# Altium schematic sheet Schemat.SchDoc
size A4
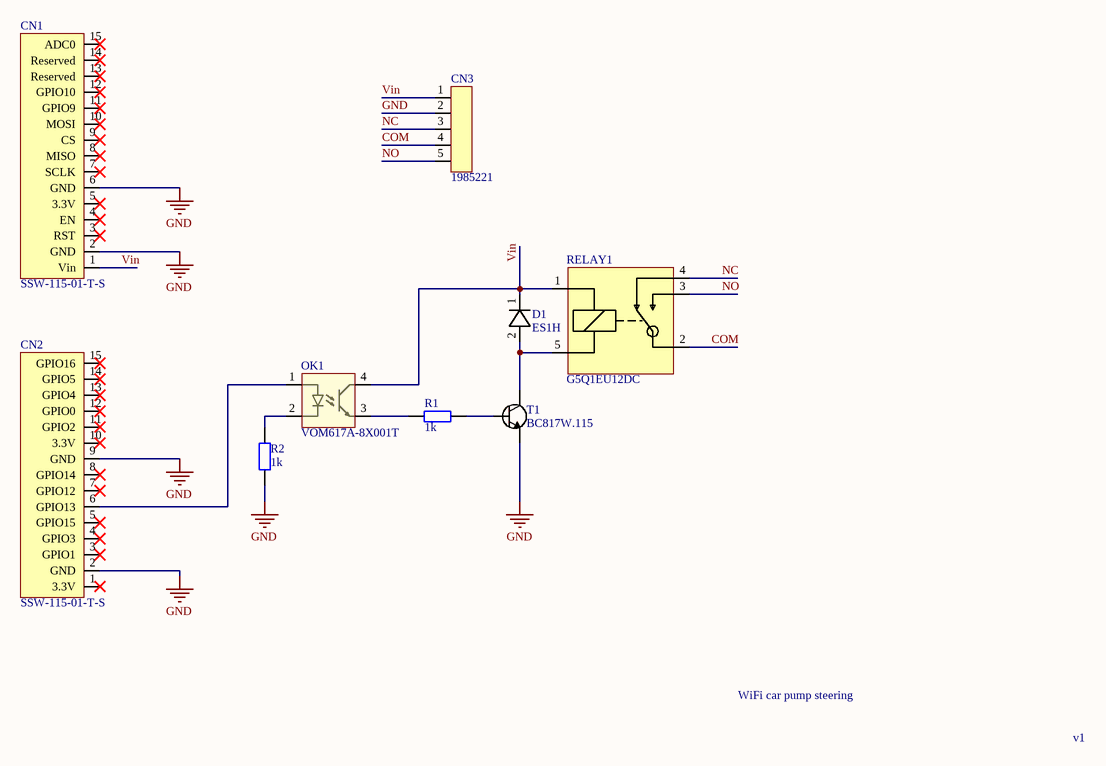
[diagram p0: Schemat.SchDoc]

## Parts
CN1  SSW-115-01-T-S  [SSW-115-01-T-S]
CN2  SSW-115-01-T-S  [SSW-115-01-T-S]
CN3  1985221  [PTSA 1.5/5-3,5-Z]
D1  ES1H  [DIOM4326X25N]
OK1  VOM617A-8X001T  [SOP254P700X200-4M]
R1  Resistance: 1k  [Resistor 1206]  (hidden comment: 1206 resistor)
R2  Resistance: 1k  [Resistor 1206]  (hidden comment: 1206 resistor)
RELAY1  G5Q1EU12DC  [G5Q-1EU 12DC]
T1  BC817W.115  [BC817W.115]

## Nets
GND: CN1.2(GND) CN1.6(GND) CN2.2(GND) CN2.9(GND) CN3.2 R2.2 T1.2(E)
COM: CN3.4 RELAY1.2(COM)
NC: CN3.3 RELAY1.4(NC)
NO: CN3.5 RELAY1.3(NO)
Vin: CN1.1(Vin) CN3.1 D1.1(C) OK1.4(C) RELAY1.1(A1)
NetCN2_6: CN2.6(GPIO13) OK1.1(A)
NetD1_2: D1.2(A) RELAY1.5(A2) T1.3(C)
NetOK1_2: OK1.2(C) R2.1
NetOK1_3: OK1.3(E) R1.1
NetR1_2: R1.2 T1.1(B)

Not connected (* = marked no-connect by the designer): CN1 3(RST)* 4(EN)* 5(3.3V)* 7(SCLK)* 8(MISO)* 9(CS)* 10(MOSI)* 11(GPIO9)* 12(GPIO10)* 13(Reserved)* 14(Reserved)* 15(ADC0)*; CN2 1(3.3V)* 3(GPIO1)* 4(GPIO3)* 5(GPIO15)* 7(GPIO12)* 8(GPIO14)* 10(3.3V)* 11(GPIO2)* 12(GPIO0)* 13(GPIO4)* 14(GPIO5)* 15(GPIO16)*

## Notes on the sheet
- WiFi car pump steering
- v1

## Library data of the parts
CN1 CN2 = SSW-115-01-T-S: SAMTEC         SSW-115-01-T-S             Board-To-Board Connector, SSW Series, 15 Contacts, Receptacle, 2.54 mm, Through Hole, 1 Rows; Number of Positions: 15; Max Current Rating: 6.9A; Contact Resistance: 10mR; Connector Type: Receptacle,Socket; Max Voltage Rating (AC): 550V; Mating Cycles: 100; Pitch: 2.54mm; Supplier 1: Farnell; Manufacturer: Samtec; Manufacturer Part Number: SSW-115-01-T-S; Stock 1: 0; Mount: Through Hole; Color: Black; Contact Plating: Tin,Matte; Contact Material: Bronze; Housing Color: Black; Housing Material: Polymer; Min Operating Temperature: -55°C; Max Operating Temperature: 105°C; Packaging: Bulk; Termination: Solder; Number of Rows: 1; Gender: Receptacle; Number of Contacts: 15; Orientation: Straight; Length: 38.61mm; Width: 2.41mm; Depth: 2.41mm; Radiation Hardening: No; REACH SVHC: No SVHC; Lead Free: Lead Free; ComponentLink1URL: http://suddendocs.samtec.com/prints/ssw-1xx-xx-xxx-x-xx-xxx-xx-mkt.pdf?src-supplier=Digi-Key; ComponentLink1Description: http://suddendocs.samtec.com/prints/ssw-1xx-xx-xxx-x-xx-xxx-xx-mkt.pdf?src-supplier=Digi-Key; Supplier Part Number 1: 1804177
CN3 = 1985221: TERM BLOCK 5POS 45DEG 3.5MM PCB; Manufacturer: Phoenix Contact; Number of Positions: 5; Voltage Rating: 250V; Max Current Rating: 2A; Number of Levels: 1; Voltage: 300V; Wire Gauge (Max): 24AWG; Wire Gauge (Min): 16AWG; Stripping Length: 8mm; Approvals: UL,VDE; Supplier 1: Farnell; Manufacturer Part Number: 1985221; Stock 1: 178; Mount: Through Hole; Number of Pins: 5; Weight: 0.087479oz; Color: Green; Housing Color: Green; Housing Material: Polyamide; Contact Material: Tin; Material: Nylon; Insulation Material: Nylon; Package Quantity: 100; Packaging: Bulk; Termination: Solder; Number of Rows: 1; Number of Contacts: 5; Number of Poles: 5; Max Supply Voltage: 250V; Current Rating: 2A; Number of Positions Per Level: 5; Current: 2A; Number of Circuits: 5; Length: 12mm; Height: 13.1mm; Width: 19mm; Pitch: 3.5mm; Depth: 12mm; Wire/Cable Gauge: 16AWG; Flammability Rating: UL94 V-2; Lead Free: Lead Free; REACH SVHC: Unknown; ComponentLink1URL: http://components.arrow.com/part/dataview/43946157S8410404N1555?src-supplier=Arrow; ComponentLink1Description: http://components.arrow.com/part/dataview/43946157S8410404N1555?src-supplier=Arrow; ComponentLink2URL: https://media.digikey.com/pdf/Data%20Sheets/Phoenix%20Contact%20PDFs/COMBICON%20Spring-Cage%20PCB%20Term.%20Blocks.pdf?src-supplier=Digi-Key; ComponentLink2Description: https://media.digikey.com/pdf/Data%20Sheets/Phoenix%20Contact%20PDFs/COMBICON%20Spring-Cage%20PCB%20Term.%20Blocks.pdf?src-supplier=Digi-Key; Supplier Part Number 1: 1792772
D1 = ES1H: Rectifiers 1A,500V,SUPER FAST Surf Mt Rect; Manufacturer: Taiwan Semiconductor; Reverse Recovery Time: 35ns; Peak Reverse Current: 100uA; Element Configuration: Single; Forward Voltage: 1.7V; Supplier 1: Farnell; Manufacturer Part Number: ES1H; Stock 1: 0; Mount: Surface Mount; Number of Pins: 2; Min Operating Temperature: -55°C; Max Operating Temperature: 150°C; Packaging: Tape and Reel; Package Quantity: 7500; Forward Current: 1A; Max Repetitive Reverse Voltage (Vrrm): 500V; Length: 4.6mm; Height: 2.5mm; Width: 2.83mm; REACH SVHC: No SVHC; Lead Free: Lead Free; ComponentLink1URL: http://uk.rs-online.com/webdocs/1298/0900766b81298786.pdf?src-supplier=RSComponents; ComponentLink1Description: http://uk.rs-online.com/webdocs/1298/0900766b81298786.pdf?src-supplier=RSComponents; ComponentLink2URL: http://www.taiwansemi.com/DSfile/ES1A%20SERIES_H13.pdf?src-supplier=Mouser; ComponentLink2Description: http://www.taiwansemi.com/DSfile/ES1A%20SERIES_H13.pdf?src-supplier=Mouser; Supplier Part Number 1: 2677280
OK1 = VOM617A-8X001T: VISHAY         VOM617A-8X001T             Transistor Output Optocoupler, Low Input Current, 1 Channel, SOP, 4 Pins, 60 mA, 3.75 kV, 130 %; Reverse Breakdown Voltage: 6V; Forward Voltage: 1.6V; Forward Current: 60mA; Max Power Dissipation: 170mW; Number of Channels: 1; Output Voltage: 80V; Collector Emitter Saturation Voltage: 400mV; Max Collector Current: 100mA; Rise Time: 7us; Fall Time: 12us; Isolation Voltage: 3.75kV; Current Transfer Ratio: 260%; Supplier 1: Farnell; Manufacturer: Vishay; Manufacturer Part Number: VOM617A-8X001T; Stock 1: 859; Mount: Surface Mount; Case/Package: SOP; Number of Pins: 4; Min Operating Temperature: -55°C; Max Operating Temperature: 110°C; Packaging: Tape and Reel; Package Quantity: 3000; Collector Emitter Voltage (VCEO): 80V; Output Current per Channel: 100mA; Number of Elements: 1; Power Dissipation: 170mW; Max Input Current: 60mA; Input Current: 60mA; Radiation Hardening: No; REACH SVHC: Unknown; ComponentLink1URL: http://www.farnell.com/datasheets/2050092.pdf?src-supplier=Element14; ComponentLink1Description: http://www.farnell.com/datasheets/2050092.pdf?src-supplier=Element14; ComponentLink2URL: http://www.vishay.com/docs/83446/vom617a.pdf?src-supplier=Avnet+Europe; ComponentLink2Description: http://www.vishay.com/docs/83446/vom617a.pdf?src-supplier=Avnet+Europe; ComponentLink3URL: http://www.vishay.com/docs/83446/vom617a.pdf?src-supplier=Digi-Key; ComponentLink3Description: http://www.vishay.com/docs/83446/vom617a.pdf?src-supplier=Digi-Key; ComponentLink4URL: http://www.vishay.com/docs/83446/vom617a.pdf?src-supplier=Avnet; ComponentLink4Description: http://www.vishay.com/docs/83446/vom617a.pdf?src-supplier=Avnet; Supplier Part Number 1: 2251591
R1 R2 = CRCW1206220RJNTABC: Resistor: thick film; SMD; 1206; 220O; 0.25W; ±5%; -55÷125°C; Manufacturer: Vishay; Power Rating: 250mW; Supplier 1: TME; Manufacturer Part Number: CRCW1206220RJNTABC; Stock 1: 277400; Pricing 1: 100=0.0314, 500=0.01833, 1000=0.01178, 5000=0.005, 15000=0.00487 (USD); Case/Package: 1206; Tolerance: 5%; Lead Free: Contains Lead; Supplier Part Number 1: CRCW1206220RJNTABC
RELAY1 = G5Q1EU12DC: PCB power relay 12 VDC 400 mW, G5Q1EU12DC, Omron Electronic Components; Contact Current Rating: 10A; Coil Resistance: 360R; Coil Current: 33.3mA; Voltage Rating (DC): 30V; Coil Voltage (DC): 12V; Coil Type: Non-Latching; Insulation Resistance: 100MR; Coil Power: 400mW; Throw Configuration: SPDT; Operate Time: 10ms; Voltage Rating (AC): 277V; Switching Capacity: 1.25kW; Ratings: IP67; Supplier 1: Farnell; Manufacturer: Omron; Manufacturer Part Number: G5Q1EU12DC; Stock 1: 634; Mount: PCB; Number of Pins: 5; Contact Material: Silver; Min Operating Temperature: -40°C; Max Operating Temperature: 85°C; Termination: PC Pin; Current Rating: 33.3mA; Contact Resistance: 100mR; Switching Current: 10A; Length: 20.3mm; Height: 15.8mm; Width: 10.3mm; Depth: 10.3mm; Radiation Hardening: No; REACH SVHC: Unknown; ComponentLink1URL: http://www.produktinfo.conrad.com/datenblaetter/500000-524999/503931-da-01-en-KOMPAKT_PCB_POWERRELAIS_G5Q_1_EU_12DC.pdf?src-supplier=Conrad; ComponentLink1Description: http://www.produktinfo.conrad.com/datenblaetter/500000-524999/503931-da-01-en-KOMPAKT_PCB_POWERRELAIS_G5Q_1_EU_12DC.pdf?src-supplier=Conrad; Supplier Part Number 1: 4446434
T1 = BC817W,115: TRANS NPN 45V 0.5A SOT323; Manufacturer: Nexperia USA; Supplier 1: Farnell; Manufacturer Part Number: BC817W,115; Stock 1: 0; Supplier Part Number 1: 2439014